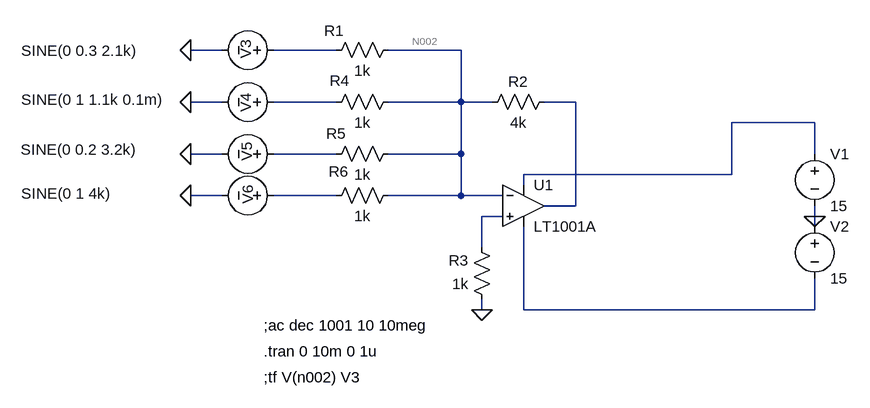
[diagram p0: schematic Comparator.asc]
Comparator.asc, the LTspice schematic file:
Version 4
SHEET 1 880 680
WIRE -144 -128 -192 -128
WIRE 32 -128 -64 -128
WIRE 224 -128 112 -128
WIRE -144 -48 -192 -48
WIRE 32 -48 -64 -48
WIRE 224 -48 224 -128
WIRE 224 -48 112 -48
WIRE 272 -48 224 -48
WIRE 400 -48 352 -48
WIRE 768 -16 640 -16
WIRE -144 32 -192 32
WIRE 32 32 -64 32
WIRE 224 32 224 -48
WIRE 224 32 112 32
WIRE 768 32 768 -16
WIRE 640 64 640 -16
WIRE 640 64 320 64
WIRE 320 80 320 64
WIRE -144 96 -192 96
WIRE 32 96 -64 96
WIRE 224 96 224 32
WIRE 224 96 112 96
WIRE 288 96 224 96
WIRE 400 112 400 -48
WIRE 400 112 352 112
WIRE 288 128 256 128
WIRE 768 128 768 112
WIRE 768 144 768 128
WIRE 256 176 256 128
WIRE 256 272 256 256
WIRE 320 272 320 144
WIRE 768 272 768 224
WIRE 768 272 320 272
FLAG -192 -128 0
FLAG 256 272 0
FLAG 768 128 0
FLAG -192 -48 0
FLAG -192 32 0
FLAG -192 96 0
SYMBOL res 128 -144 R90
WINDOW 0 2 99 VBottom 2
WINDOW 3 32 56 VTop 2
SYMATTR InstName R1
SYMATTR Value 1k
SYMBOL res 368 -64 R90
WINDOW 0 0 56 VBottom 2
WINDOW 3 32 56 VTop 2
SYMATTR InstName R2
SYMATTR Value 4k
SYMBOL res 272 272 R180
WINDOW 0 36 76 Left 2
WINDOW 3 36 40 Left 2
SYMATTR InstName R3
SYMATTR Value 1k
SYMBOL voltage 768 16 R0
WINDOW 123 0 0 Left 2
WINDOW 39 0 0 Left 2
SYMATTR InstName V1
SYMATTR Value 15
SYMBOL voltage 768 128 R0
WINDOW 123 0 0 Left 2
WINDOW 39 0 0 Left 2
SYMATTR InstName V2
SYMATTR Value 15
SYMBOL Opamps\\LT1001A 320 48 R0
SYMATTR InstName U1
SYMBOL voltage -48 -128 R90
WINDOW 0 -16 59 Left 2
WINDOW 3 1 226 VRight 2
WINDOW 123 -154 130 Left 2
WINDOW 39 0 0 Left 2
SYMATTR InstName V3
SYMATTR Value SINE(0 0.3 2.1k)
SYMBOL res 128 -64 R90
WINDOW 0 -1 91 VBottom 2
WINDOW 3 32 56 VTop 2
SYMATTR InstName R4
SYMATTR Value 1k
SYMBOL voltage -48 -48 R90
WINDOW 0 -14 59 Left 2
WINDOW 3 -4 186 VRight 2
WINDOW 123 -154 130 Left 2
WINDOW 39 0 0 Left 2
SYMATTR InstName V4
SYMATTR Value SINE(0 1 1.1k 0.1m)
SYMBOL res 128 16 R90
WINDOW 0 0 96 VBottom 2
WINDOW 3 32 56 VTop 2
SYMATTR InstName R5
SYMATTR Value 1k
SYMBOL voltage -48 32 R90
WINDOW 0 -18 58 Left 2
WINDOW 3 -7 227 VRight 2
WINDOW 123 -30 86 VRight 2
WINDOW 39 0 0 Left 2
SYMATTR InstName V5
SYMATTR Value SINE(0 0.2 3.2k)
SYMBOL res 128 80 R90
WINDOW 0 -5 92 VBottom 2
WINDOW 3 32 56 VTop 2
SYMATTR InstName R6
SYMATTR Value 1k
SYMBOL voltage -48 96 R90
WINDOW 0 -16 56 Left 2
WINDOW 3 -3 267 VRight 2
WINDOW 123 -25 87 VRight 2
WINDOW 39 0 0 Left 2
SYMATTR InstName V6
SYMATTR Value SINE(0 1 4k)
TEXT -80 336 Left 2 !.tran 0 10m 0 1u
TEXT -80 376 Left 2 !;tf V(n002) V3
TEXT -80 296 Left 2 !;ac dec 1001 10 10meg

The netlist it stands for:
* Comparator.asc
R1 N002 N001 1k
R2 N004 N002 4k
R3 0 N008 1k
V1 N005 0 15
V2 0 N009 15
XU1 N008 N002 N005 N009 N004 LT1001  ; LT1001A, pins In+ In- V+ V- OUT
V3 N001 0 SINE(0 0.3 2.1k)
R4 N002 N003 1k
V4 N003 0 SINE(0 1 1.1k 0.1m)
R5 N002 N006 1k
V5 N006 0 SINE(0 0.2 3.2k)
R6 N002 N007 1k
V6 N007 0 SINE(0 1 4k)
.tran 0 10m 0 1u
;tf V(n002) V3
;ac dec 1001 10 10meg
.lib LTC.lib
.backanno
.end